# Altium schematic sheet E73-2G4M08S1C1_E73-2G4M08S1C.schdoc
size 124 x 101 mm
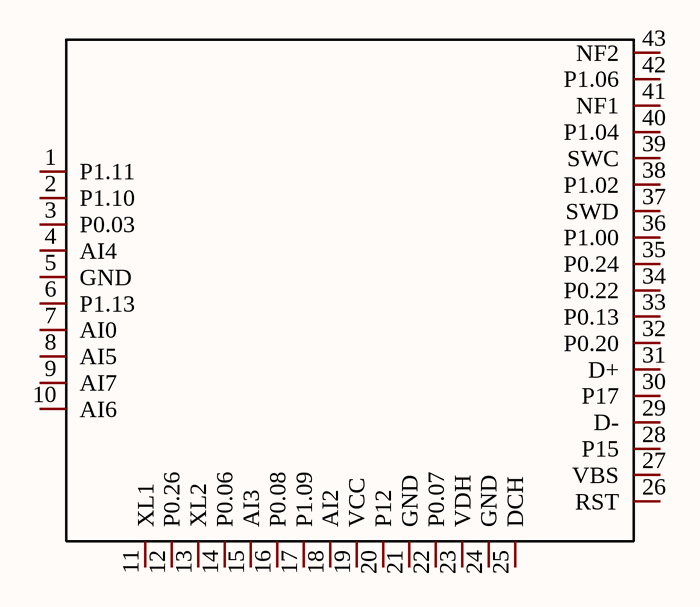
[diagram p0: E73-2G4M08S1C1_E73-2G4M08S1C.schdoc]

## Parts
U?  E73-2G4M08S1C  [WIRELM-SMD_E73-2G4M08S1C]  (value not drawn)

## Nets

Not connected (* = marked no-connect by the designer): U? 1(P1.11) 2(P1.10) 3(P0.03) 4(AI4) 5(GND) 6(P1.13) 7(AI0) 8(AI5) 9(AI7) 10(AI6) 11(XL1) 12(P0.26) 13(XL2) 14(P0.06) 15(AI3) 16(P0.08) 17(P1.09) 18(AI2) 19(VCC) 20(P12) 21(GND) 22(P0.07) 23(VDH) 24(GND) 25(DCH) 26(RST) 27(VBS) 28(P15) 29(D-) 30(P17) 31(D+) 32(P0.20) 33(P0.13) 34(P0.22) 35(P0.24) 36(P1.00) 37(SWD) 38(P1.02) 39(SWC) 40(P1.04) 41(NF1) 42(P1.06) 43(NF2)

## Library data of the parts
U? = E73-2G4M08S1C: Manufacturer: EBYTE(亿佰特); Add into BOM: yes; Symbol: E73-2G4M08S1C; Device: E73-2G4M08S1C; LCSC Part Name: E73-2G4M08S1C; Supplier Part: C356849; Manufacturer Part: E73-2G4M08S1C; Supplier Footprint: -; JLCPCB Part Class: Extended Part; Datasheet: https://atta.szlcsc.com/upload/public/pdf/source/20190802/C356849_057FD2ABDA7635054C2E243A545E6C9F.pdf; Supplier: LCSC; Convert to PCB: yes